# Altium schematic sheet 6_DRAMBanks.SchDoc: DRAM Signals (Banks 34-35)
size Legal; Date: 12/28/2025; Author: Praveen Perera; DrawnBy: Praveen Perera; Engineer: Praveen Perera; Revision: 1; SheetNumber: 6; SheetTotal: 9
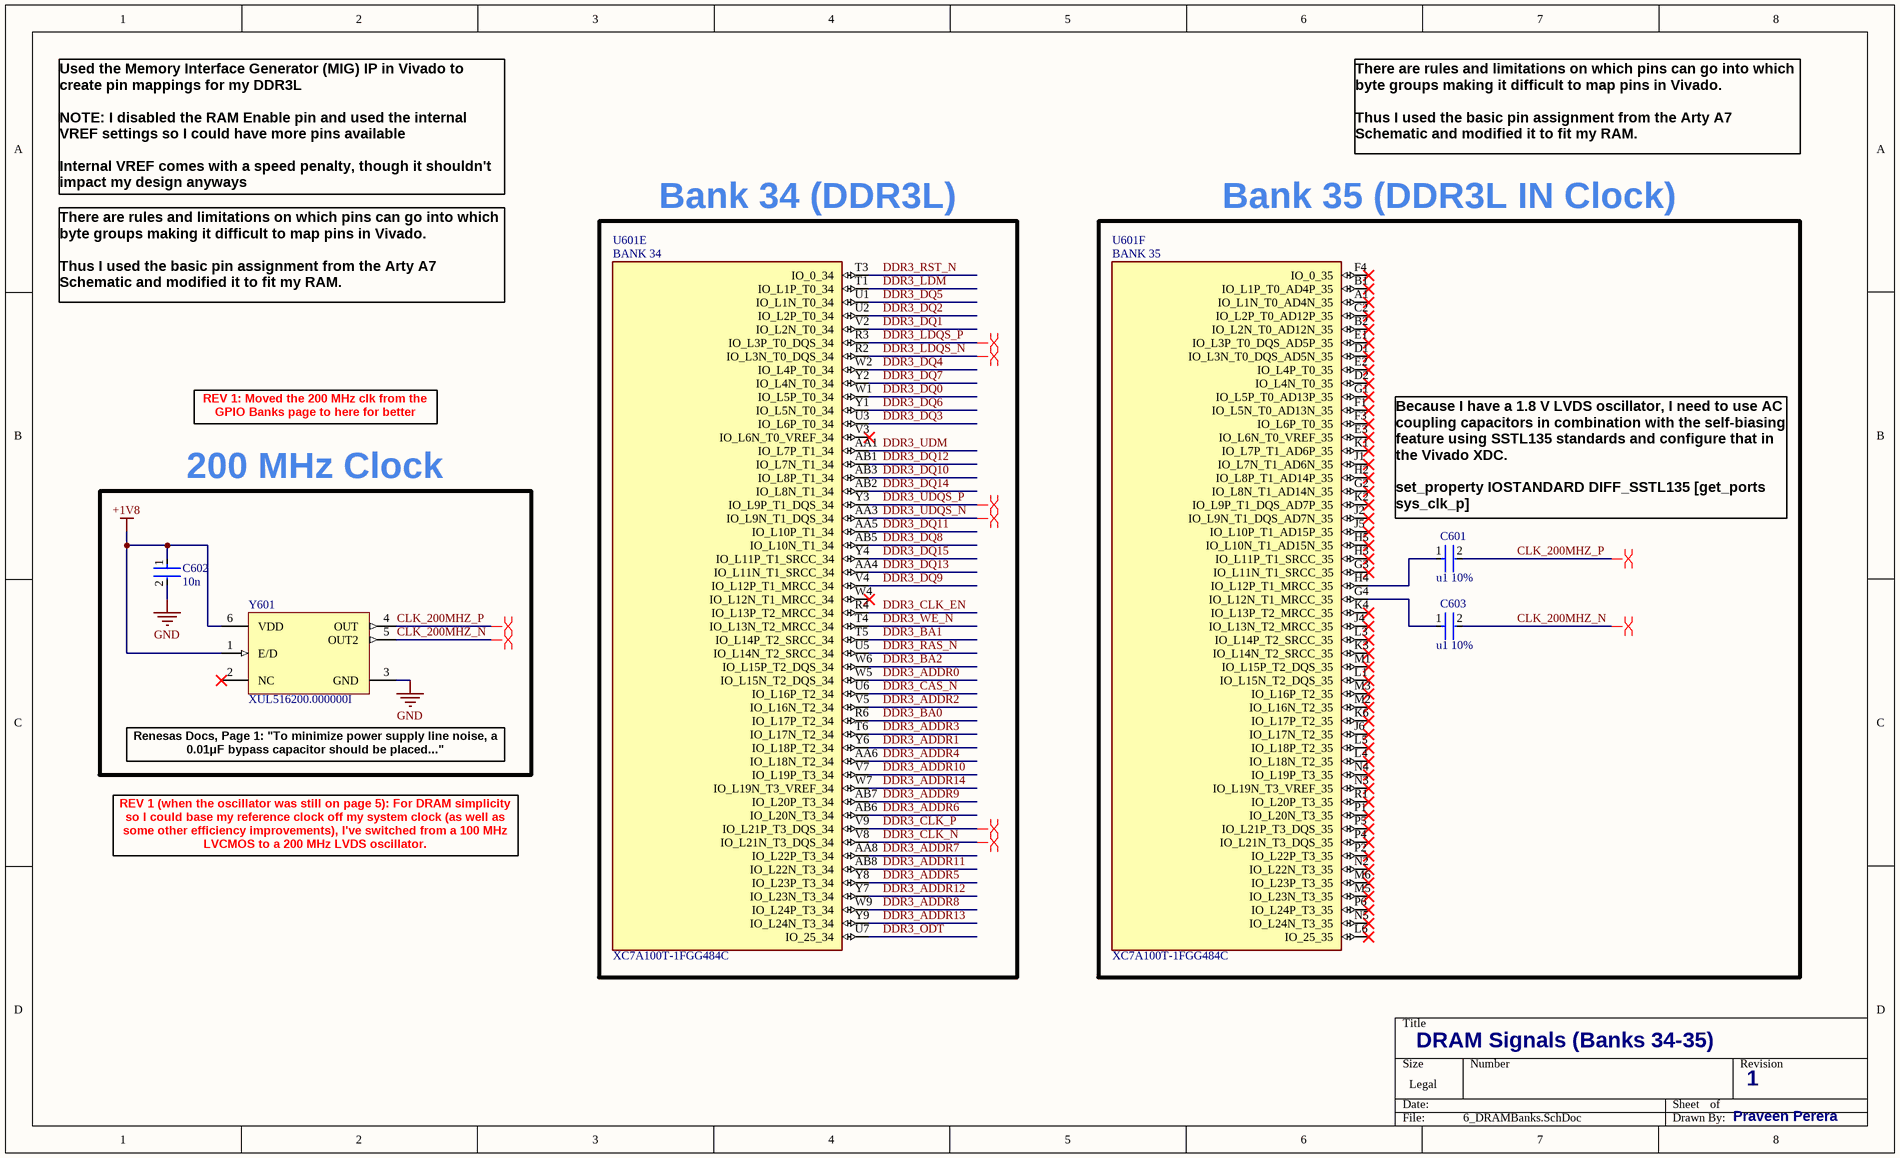
[diagram p0: 6_DRAMBanks.SchDoc]

## Parts
C601  u1 10%  [FP-CL891-IPC_C]
C602  10n  [FP-GCM155-0_05-IPC_C]
C603  u1 10%  [FP-CL891-IPC_C]
U601  XC7A100T-1FGG484C  [BGA484C100P22X22_2300X2300X260N]  (parts E,F of 14)
Y601  XUL516200.000000I  [JS6_MFG]

## Nets
+1V8: C602.1 Y601.1(E/D) Y601.6(VDD)
GND: C602.2 Y601.3(GND)
CLK_200MHZ_N: C603.2 Y601.5(OUT2)
CLK_200MHZ_P: C601.2 Y601.4(OUT)
DDR3_ADDR0: U601.W5(IO_L15N_T2_DQS_34)
DDR3_ADDR1: U601.Y6(IO_L18P_T2_34)
DDR3_ADDR2: U601.V5(IO_L16N_T2_34)
DDR3_ADDR3: U601.T6(IO_L17N_T2_34)
DDR3_ADDR4: U601.AA6(IO_L18N_T2_34)
DDR3_ADDR5: U601.Y8(IO_L23P_T3_34)
DDR3_ADDR6: U601.AB6(IO_L20N_T3_34)
DDR3_ADDR7: U601.AA8(IO_L22P_T3_34)
DDR3_ADDR8: U601.W9(IO_L24P_T3_34)
DDR3_ADDR9: U601.AB7(IO_L20P_T3_34)
DDR3_ADDR10: U601.V7(IO_L19P_T3_34)
DDR3_ADDR11: U601.AB8(IO_L22N_T3_34)
DDR3_ADDR12: U601.Y7(IO_L23N_T3_34)
DDR3_ADDR13: U601.Y9(IO_L24N_T3_34)
DDR3_ADDR14: U601.W7(IO_L19N_T3_VREF_34)
DDR3_BA0: U601.R6(IO_L17P_T2_34)
DDR3_BA1: U601.T5(IO_L14P_T2_SRCC_34)
DDR3_BA2: U601.W6(IO_L15P_T2_DQS_34)
DDR3_CAS_N: U601.U6(IO_L16P_T2_34)
DDR3_CLK_EN: U601.R4(IO_L13P_T2_MRCC_34)
DDR3_CLK_N: U601.V8(IO_L21N_T3_DQS_34)
DDR3_CLK_P: U601.V9(IO_L21P_T3_DQS_34)
DDR3_DQ0: U601.W1(IO_L5P_T0_34)
DDR3_DQ1: U601.V2(IO_L2N_T0_34)
DDR3_DQ2: U601.U2(IO_L2P_T0_34)
DDR3_DQ3: U601.U3(IO_L6P_T0_34)
DDR3_DQ4: U601.W2(IO_L4P_T0_34)
DDR3_DQ5: U601.U1(IO_L1N_T0_34)
DDR3_DQ6: U601.Y1(IO_L5N_T0_34)
DDR3_DQ7: U601.Y2(IO_L4N_T0_34)
DDR3_DQ8: U601.AB5(IO_L10N_T1_34)
DDR3_DQ9: U601.V4(IO_L12P_T1_MRCC_34)
DDR3_DQ10: U601.AB3(IO_L8P_T1_34)
DDR3_DQ11: U601.AA5(IO_L10P_T1_34)
DDR3_DQ12: U601.AB1(IO_L7N_T1_34)
DDR3_DQ13: U601.AA4(IO_L11N_T1_SRCC_34)
DDR3_DQ14: U601.AB2(IO_L8N_T1_34)
DDR3_DQ15: U601.Y4(IO_L11P_T1_SRCC_34)
DDR3_LDM: U601.T1(IO_L1P_T0_34)
DDR3_LDQS_N: U601.R2(IO_L3N_T0_DQS_34)
DDR3_LDQS_P: U601.R3(IO_L3P_T0_DQS_34)
DDR3_ODT: U601.U7(IO_25_34)
DDR3_RAS_N: U601.U5(IO_L14N_T2_SRCC_34)
DDR3_RST_N: U601.T3(IO_0_34)
DDR3_UDM: U601.AA1(IO_L7P_T1_34)
DDR3_UDQS_N: U601.AA3(IO_L9N_T1_DQS_34)
DDR3_UDQS_P: U601.Y3(IO_L9P_T1_DQS_34)
DDR3_WE_N: U601.T4(IO_L13N_T2_MRCC_34)
NetC601_1: C601.1 U601.H4(IO_L12P_T1_MRCC_35)
NetC603_1: C603.1 U601.G4(IO_L12N_T1_MRCC_35)

Not connected (* = marked no-connect by the designer): U601 A1(IO_L1N_T0_AD4N_35)* B1(IO_L1P_T0_AD4P_35)* B2(IO_L2N_T0_AD12N_35)* C2(IO_L2P_T0_AD12P_35)* D1(IO_L3N_T0_DQS_AD5N_35)* D2(IO_L4N_T0_35)* E1(IO_L3P_T0_DQS_AD5P_35)* E2(IO_L4P_T0_35)* E3(IO_L6N_T0_VREF_35)* F1(IO_L5N_T0_AD13N_35)* F3(IO_L6P_T0_35)* F4(IO_0_35)* G1(IO_L5P_T0_AD13P_35)* G2(IO_L8N_T1_AD14N_35)* G3(IO_L11N_T1_SRCC_35)* H2(IO_L8P_T1_AD14P_35)* H3(IO_L11P_T1_SRCC_35)* H5(IO_L10N_T1_AD15N_35)* J1(IO_L7N_T1_AD6N_35)* J2(IO_L9N_T1_DQS_AD7N_35)* J4(IO_L13N_T2_MRCC_35)* J5(IO_L10P_T1_AD15P_35)* J6(IO_L17N_T2_35)* K1(IO_L7P_T1_AD6P_35)* K2(IO_L9P_T1_DQS_AD7P_35)* K3(IO_L14N_T2_SRCC_35)* K4(IO_L13P_T2_MRCC_35)* K6(IO_L17P_T2_35)* L1(IO_L15N_T2_DQS_35)* L3(IO_L14P_T2_SRCC_35)* L4(IO_L18N_T2_35)* L5(IO_L18P_T2_35)* L6(IO_25_35)* M1(IO_L15P_T2_DQS_35)* M2(IO_L16N_T2_35)* M3(IO_L16P_T2_35)* M5(IO_L23N_T3_35)* M6(IO_L23P_T3_35)* N2(IO_L22N_T3_35)* N3(IO_L19N_T3_VREF_35)* N4(IO_L19P_T3_35)* N5(IO_L24N_T3_35)* P1(IO_L20N_T3_35)* P2(IO_L22P_T3_35)* P4(IO_L21N_T3_DQS_35)* P5(IO_L21P_T3_DQS_35)* P6(IO_L24P_T3_35)* R1(IO_L20P_T3_35)* V3(IO_L6N_T0_VREF_34)* W4(IO_L12N_T1_MRCC_34)*; Y601 2(NC)*

## Layout directives
differential pair: CLK_200MHZ_N, CLK_200MHZ_P, DDR3_CLK_N, DDR3_CLK_P, DDR3_LDQS_N, DDR3_LDQS_P, DDR3_UDQS_N, DDR3_UDQS_P

## Notes on the sheet
- There are rules and limitations on which pins can go into which byte groups making it difficult to map pins in Vivado.
  Thus I used the basic pin assignment from the Arty A7 Schematic and modified it to fit my RAM.
- Used the Memory Interface Generator (MIG) IP in Vivado to create pin mappings for my DDR3L
  NOTE: I disabled the RAM Enable pin and used the internal VREF settings so I could have more pins available
  Internal VREF comes with a speed penalty, though it shouldn't impact my design anyways
- Bank 34 (DDR3L)
- Bank 35 (DDR3L IN Clock)
- REV 1: Moved the 200 MHz clk from the GPIO Banks page to here for better organization.
- 200 MHz Clock
- Because I have a 1.8 V LVDS oscillator, I need to use AC coupling capacitors in combination with the self-biasing feature using SSTL135 standards and configure that in the Vivado XDC.
  set_property IOSTANDARD DIFF_SSTL135 [get_ports sys_clk_p]
  set_property DIFF_TERM TRUE [get_ports sys_clk_p]
- (near Y601) Renesas Docs, Page 1: "To minimize power supply line noise, a 0.01μF bypass capacitor should be placed..."
- REV 1 (when the oscillator was still on page 5): For DRAM simplicity so I could base my reference clock off my system clock (as well as some other efficiency improvements), I've switched from a 100 MHz LVCMOS to a 200 MHz LVDS oscillator.
- (in symbol XC7A100T-1FGG484C, part E) BANK 34
- (in symbol XC7A100T-1FGG484C, part F) BANK 35

## Library data of the parts
C601 C603 = CMP-13271-001945-1: CL05B104KB5NNNC / Cap Ceramic 100nF 50V X7R ±10% SMD 0402 +125°C Paper T/R
C602 = CMP-2008-03715-2: GCM155R71E103KA37D / Ceramic Capacitor for Automotive 10nF ±10% 25VDC X7R 0402 Paper T/R; Voltage Rating (DC): 25V; Packaging: Tape and Reel; Case/Package: 0402; Max Operating Temperature: 125°C; Radiation Hardening: No; Case Code (Metric): 1005; Termination: SMD/SMT; Mount: Surface Mount; Voltage: 25V; Width: 0.02inch; Dielectric: X7R; Height: 0.5mm; Depth: 0.5mm; Length: 1mm; Package Quantity: 1; Thickness: 0.022inch; Voltage Rating: 25V; Case Code (Imperial): 0402; Ratings: AEC-Q200; Capacitance: 10nF; REACH SVHC: No SVHC; Lead Free: Lead Free; Min Operating Temperature: -55°C; Tolerance: 10%
U601 = XC7A100T-1FGG484C: Artix-7 Field Programmable Gate Array (FPGA) IC 285 4976640 101440 484-BBGA; MF: Xilinx Inc.; Value: *; Check_prices: https://www.snapeda.com/parts/XC7A100T-1FGG484C/Xilinx/view-part/?ref=eda; MP: XC7A100T-1FGG484C; SnapEDA_Link: https://www.snapeda.com/parts/XC7A100T-1FGG484C/Xilinx/view-part/?ref=snap; Package: FBGA-484 Xilinx
Y601 = CMP-00572-107107086-3: Crystal Oscillator 200MHz LVDS 1.8VDC ±25ppm ‐40 to +85°C 4-Pin SMD 5x3.2mm Cut Tape; Min Input Voltage: 1.71V; Max Output Frequency: 999.9MHz; Max Input Voltage: 1.89V; ComponentLink1URL: http://www.renesas.com; ComponentLink2URL: https://octopart.com/cad-content/api/get-model-datasheet/15189/107107086; HelpURL: https://octopart.com/cad-content/api/get-model-datasheet/15189/107107086; ComponentLink3Description: Manufacturer's Package Drawing; Mount: Surface Mount; Number of Pins: 6; Min Operating Temperature: -40°C; Case/Package: CLCC; Height: 1.2mm; ComponentLink2Description: Datasheet URL; ComponentLink1Description: Manufacturer's Website; ComponentLink3URL: https://www.renesas.com/en/document/psc/js6-package-outline-50-x-32-mm-body-11-mm-thick; Max Operating Temperature: 85°C; RoHS: Compliant; Output Type: LVDS